# Altium schematic sheet PowerSupply.SchDoc
size A3; SheetNumber: 3; SheetTotal: 3; SPICEModelCacheXISURGRH: <root> / <DocumentId>XISURGRH</DocumentId> / <CacheFrame Number="0"> / <Model Name="cap" Kind="MDL"> / <Text>*Default semiconductor capacitor / .MODEL CAP C()</Text> / </Model> / </CacheFrame> / </root>
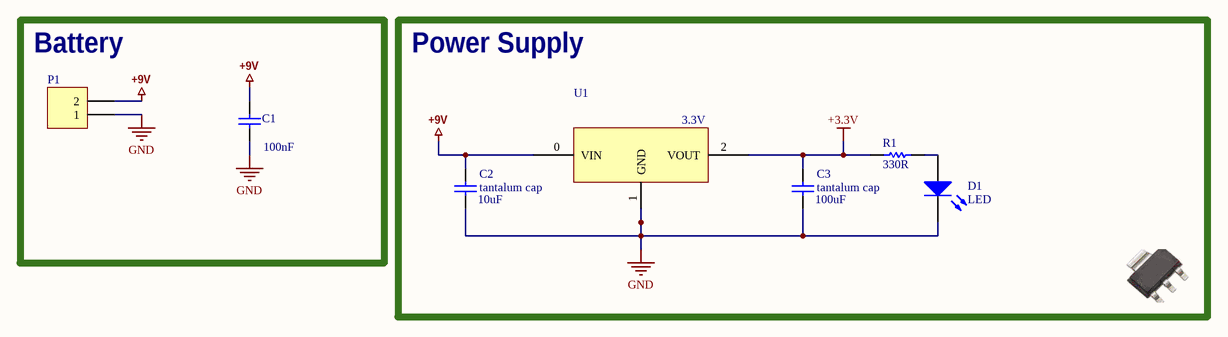
[diagram p0: PowerSupply.SchDoc]

## Parts
C1  value 100nF  [C1206]
C2  tantalum cap  value 10uF  [C1206tancap]
C3  tantalum cap  value 100uF  [C1206tancap]
D1  LED  [MY_LED_0805]
P1  (no value)  [HDR1X2H]
R1  330R  [MY_0805]
U1  output voltage: 3.3V  [4-Pin SOT]

## Blocks framed on the sheet
Battery: C1 P1
Power Supply: C2 C3 D1 R1 U1

## Nets
+3.3V: C3.2 R1.1 U1.2(VOUT)
+9V: C1.2 C2.2 P1.2 U1.0(VIN)
GND: C1.1 C2.1 C3.1 D1.K P1.1 U1.1(GND)
NetD1_A: D1.A R1.2

## Library data of the parts
C1 = Cap Semi: Capacitor (Semiconductor SIM Model); Published: 8-Jun-2000; LatestRevisionDate: 29-May-2009; LatestRevisionNote: IPC-7351 Footprint Added.; PackageReference: C1206; Publisher: Altium Limited; PackageDescription: Chip Capacitor
C2 C3 = Cap Semi_5: Capacitor (Semiconductor SIM Model); Published: 8-Jun-2000; LatestRevisionDate: 29-May-2009; LatestRevisionNote: IPC-7351 Footprint Added.; PackageReference: C1206; Publisher: Altium Limited; PackageDescription: Chip Capacitor
D1 = LED: Typical INFRARED GaAs LED; ASiD Part Number: LED-AS
P1 = Header 2H: Header, 2-Pin, Right Angle; LatestRevisionDate: 17-Jul-2002; LatestRevisionNote: Re-released for DXP Platform.; Publisher: Altium Limited
R1 = Res: Standard resistor; ASiD Part Number: Res-AS; Value: 330R
U1 = lm1117: The LM1117 is a low dropout voltage regulator with a dropout of 1.2 V at 800 mA of load current. / The  LM1117  is  available  in  an  adjustable  version, which can set the output voltage from 1.25 V to 13.8 V with only two external resistors. In addition, the device is available in five fixed voltages, 1.8 V, 2.5 V, 3.3 V, and 5 V. / The  LM1117  offers  current  limiting  and  thermal shutdown. The circuit includes a Zener trimmed band-gap  reference  to  assure  output  voltage  accuracy  to within ±1%. / A  minimum  of  10-µF  tantalum  capacitor  is  required at  the  output  to  improve  the  transient  response  and stability.; ComponentLink1Description: Product deatils; ComponentLink1URL: https://www.ti.com/product/LM1117; ComponentLink2Description: Datasheet; ComponentLink2URL: https://www.ti.com/lit/ds/symlink/lm1117.pdf